# Altium schematic sheet source.SchDoc
size A4
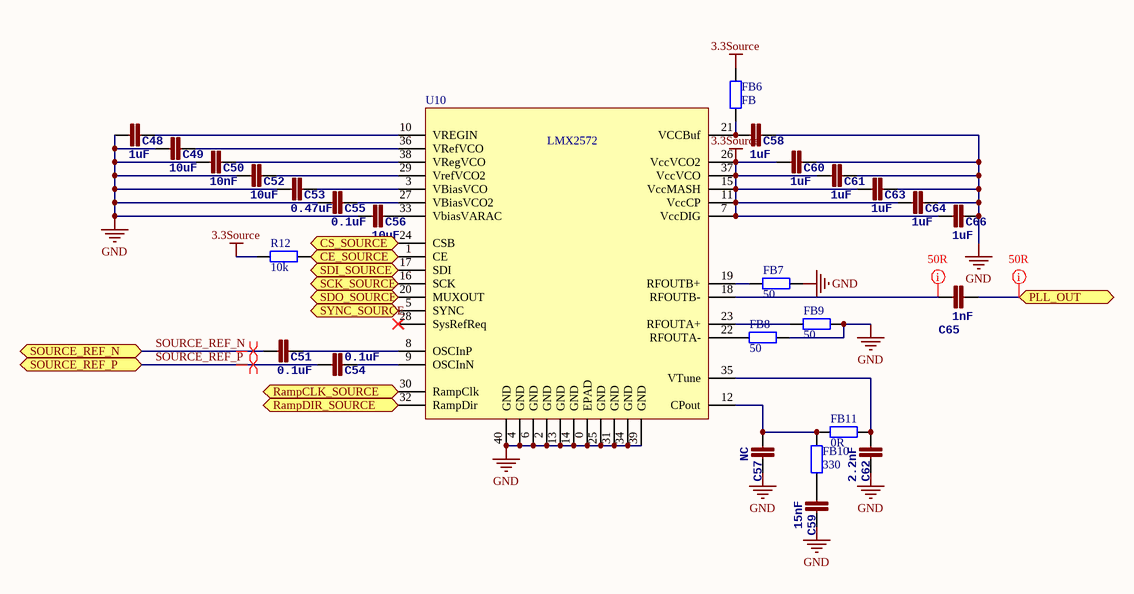
[diagram p0: source.SchDoc]

## Parts
C48  1uF  [0201]
C49  10uF  [0402]
C50  10nF  [0201]
C51  0.1uF  [0201]
C52  10uF  [0402]
C53  0.47uF  [0402]
C54  0.1uF  [0201]
C55  0.1uF  [0201]
C56  10uF  [0402]
C57  NC  [0201]
C58  1uF  [0201]
C59  15nF  [0201]
C60  1uF  [0201]
C61  1uF  [0201]
C62  2.2nF  [0201]
C63  1uF  [0201]
C64  1uF  [0201]
C65  1nF  [0402]
C66  1uF  [0201]
FB6  FB  [0402]
FB7  50  [0201]
FB8  50  [0201]
FB9  50  [0201]
FB10  330  [0201]
FB11  0R  [0201]
R12  10k  [0402]
U10  LMX2572  [LMX2572]

## Ports
CE_SOURCE, CS_SOURCE, PLL_OUT, RampCLK_SOURCE, RampDIR_SOURCE, SCK_SOURCE, SDI_SOURCE, SDO_SOURCE, SOURCE_REF_N, SOURCE_REF_P, SYNC_SOURCE

## Nets
3.3Source: C60.1 C61.1 C63.1 C64.1 C66.1 FB6.1 R12.1 U10.7(VccDIG) U10.11(VccCP) U10.15(VccMASH) U10.26(VccVCO2) U10.37(VccVCO)
GND: C48.1 C49.1 C50.1 C52.1 C53.1 C55.1 C56.1 C57.2 C58.2 C59.2 C60.2 C61.2 C62.2 C63.2 C64.2 C66.2 FB7.1 FB8.1 FB9.1 U10.0(EPAD) U10.2(GND) U10.4(GND) U10.6(GND) U10.13(GND) U10.14(GND) U10.25(GND) U10.31(GND) U10.34(GND) U10.39(GND) U10.40(GND)
CE_SOURCE: R12.2 U10.1(CE) ; port CE_SOURCE
CS_SOURCE: U10.24(CSB) ; port CS_SOURCE
PLL_OUT: C65.2 ; port PLL_OUT
RampCLK_SOURCE: U10.30(RampClk) ; port RampCLK_SOURCE
RampDIR_SOURCE: U10.32(RampDir) ; port RampDIR_SOURCE
SCK_SOURCE: U10.16(SCK) ; port SCK_SOURCE
SDI_SOURCE: U10.17(SDI) ; port SDI_SOURCE
SDO_SOURCE: U10.20(MUXOUT) ; port SDO_SOURCE
SOURCE_REF_N: C51.1 ; port SOURCE_REF_N
SOURCE_REF_P: C54.1 ; port SOURCE_REF_P
SYNC_SOURCE: U10.5(SYNC) ; port SYNC_SOURCE
NetC48_2: C48.2 U10.10(VREGIN)
NetC49_2: C49.2 U10.36(VRefVCO)
NetC50_2: C50.2 U10.38(VRegVCO)
NetC51_2: C51.2 U10.8(OSCInP)
NetC52_2: C52.2 U10.29(VrefVCO2)
NetC53_2: C53.2 U10.3(VBiasVCO)
NetC54_2: C54.2 U10.9(OSCInN)
NetC55_2: C55.2 U10.27(VBiasVCO2)
NetC56_2: C56.2 U10.33(VbiasVARAC)
NetC57_1: C57.1 FB10.2 FB11.2 U10.12(CPout)
NetC58_1: C58.1 FB6.2 U10.21(VCCBuf)
NetC59_1: C59.1 FB10.1
NetC62_1: C62.1 FB11.1 U10.35(VTune)
NetC65_1: C65.1 U10.18(RFOUTB-)
NetFB7_2: FB7.2 U10.19(RFOUTB+)
NetFB8_2: FB8.2 U10.22(RFOUTA-)
NetFB9_2: FB9.2 U10.23(RFOUTA+)

Not connected (* = marked no-connect by the designer): U10 28(SysRefReq)*

## Layout directives
net class 50R: NetC65_1, PLL_OUT
differential pair: SOURCE_REF_N, SOURCE_REF_P

## Library data of the parts
C48-C66 = CAP0402-CAP: <b>Capacitor</b> / Standard 0603 ceramic capacitor, and 0.1" leaded capacitor.; PARTNO: CC0402ZRY5V7BB104
FB6-FB11 R12 = Res2: Resistor; Published: 8-Jun-2000; LatestRevisionDate: 17-Jul-2002; LatestRevisionNote: Re-released for DXP Platform.; PackageReference: AXIAL-0.4; Publisher: Altium Limited; PackageDescription: Axial Device, Thru-Hole; 2 Leads; 0.4 in Pin Spacing